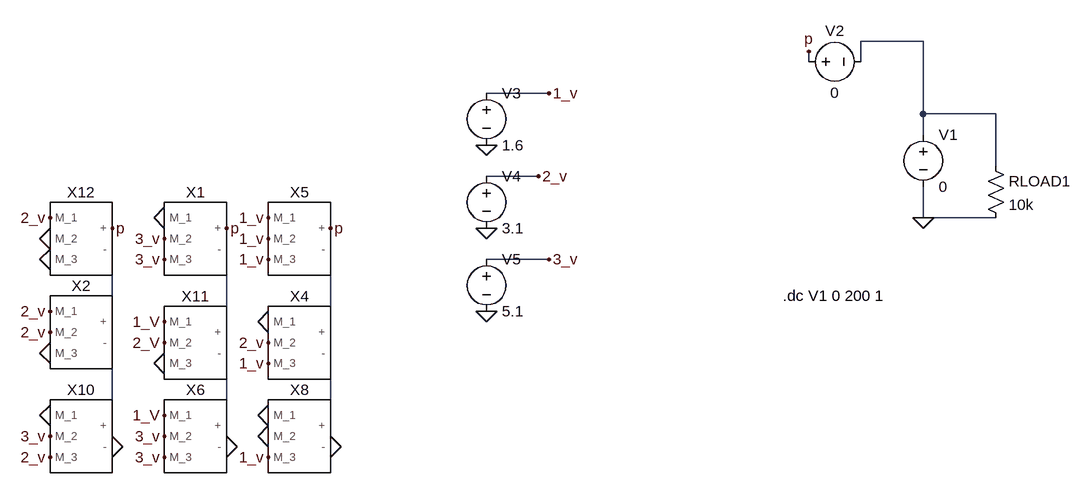
[diagram p0: schematic after.asc]
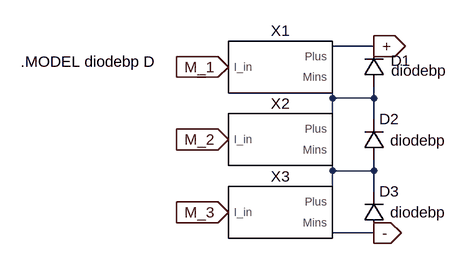
[diagram p1: sub-circuit pv_panel.asc]
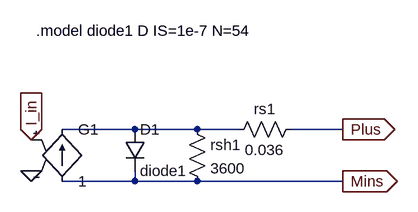
[diagram p2: sub-circuit module.asc]
after.asc, the LTspice schematic file:
Version 4
SHEET 1 1220 680
WIRE 928 -192 832 -192
WIRE 752 -160 752 -176
WIRE 832 -160 832 -192
WIRE 352 -112 256 -112
WIRE 928 -80 928 -192
WIRE 1040 -80 928 -80
WIRE 928 -48 928 -80
WIRE 1040 0 1040 -80
WIRE 336 16 256 16
WIRE 928 80 928 32
WIRE 1040 80 928 80
WIRE 352 144 256 144
WIRE -320 240 -320 128
WIRE -144 256 -144 128
WIRE 16 256 16 128
WIRE -320 400 -320 272
WIRE -144 400 -144 288
WIRE 16 400 16 288
FLAG 928 80 0
FLAG 16 432 0
FLAG -240 112 3_v
FLAG -240 144 3_v
FLAG -240 416 3_v
FLAG -240 448 3_v
FLAG -416 416 3_v
FLAG -80 80 1_v
FLAG -80 112 1_v
FLAG -80 144 1_v
FLAG -80 304 1_v
FLAG -80 448 1_v
FLAG -416 224 2_v
FLAG -416 256 2_v
FLAG -80 272 2_v
FLAG -416 80 2_v
FLAG -416 448 2_v
FLAG -416 288 0
FLAG -240 80 0
FLAG -416 384 0
FLAG -240 304 0
FLAG -416 112 0
FLAG -416 144 0
FLAG -80 416 0
FLAG -80 384 0
FLAG 752 -176 p
FLAG 16 96 p
FLAG -144 96 p
FLAG -320 432 0
FLAG -144 432 0
FLAG -320 96 p
FLAG -80 240 0
FLAG -240 384 1_V
FLAG -240 240 1_V
FLAG -240 272 2_V
FLAG 256 -32 0
FLAG 256 96 0
FLAG 256 224 0
FLAG 352 -112 1_v
FLAG 336 16 2_v
FLAG 352 144 3_v
SYMBOL PV_panel -192 112 R0
SYMATTR InstName X1
SYMBOL PV_panel -368 256 R0
SYMATTR InstName X2
SYMBOL PV_panel -32 272 R0
SYMATTR InstName X4
SYMBOL PV_panel -32 112 R0
SYMATTR InstName X5
SYMBOL PV_panel -192 416 R0
SYMATTR InstName X6
SYMBOL PV_panel -32 416 R0
SYMATTR InstName X8
SYMBOL PV_panel -368 416 R0
SYMATTR InstName X10
SYMBOL PV_panel -192 272 R0
SYMATTR InstName X11
SYMBOL PV_panel -368 112 R0
SYMATTR InstName X12
SYMBOL voltage 928 -64 R0
SYMATTR InstName V1
SYMATTR Value 0
SYMBOL voltage 736 -160 R270
WINDOW 0 32 56 VTop 2
WINDOW 3 -32 56 VBottom 2
SYMATTR InstName V2
SYMATTR Value 0
SYMBOL res 1024 -16 R0
SYMATTR InstName RLOAD1
SYMATTR Value 10k
SYMBOL voltage 256 -128 R0
SYMATTR InstName V3
SYMATTR Value 1.6
SYMBOL voltage 256 0 R0
SYMATTR InstName V4
SYMATTR Value 3.1
SYMBOL voltage 256 128 R0
SYMATTR InstName V5
SYMATTR Value 5.1
TEXT 712 200 Left 2 !.dc V1 0 200 1

pv_panel.asc, the sub-circuit schematic file:
Version 4
SHEET 1 880 680
WIRE 352 96 288 96
WIRE 288 112 288 96
WIRE 288 176 288 144
WIRE 352 176 352 160
WIRE 352 176 288 176
WIRE 352 208 352 176
WIRE 288 224 288 176
WIRE 288 288 288 256
WIRE 352 288 352 272
WIRE 352 288 288 288
WIRE 352 320 352 288
WIRE 288 336 288 288
WIRE 288 384 288 368
WIRE 352 384 288 384
FLAG 128 128 M_1
IOPIN 128 128 In
FLAG 128 240 M_2
IOPIN 128 240 In
FLAG 128 352 M_3
IOPIN 128 352 In
FLAG 352 96 +
IOPIN 352 96 Out
FLAG 352 384 -
IOPIN 352 384 Out
SYMBOL module 208 128 R0
SYMATTR InstName X1
SYMBOL module 208 240 R0
SYMATTR InstName X2
SYMBOL module 208 352 R0
SYMATTR InstName X3
SYMBOL diode 336 160 M180
WINDOW 0 42 42 Left 2
WINDOW 3 43 26 Left 2
SYMATTR InstName D1
SYMATTR Value diodebp
SYMBOL diode 336 272 M180
WINDOW 0 24 64 Left 2
WINDOW 3 41 31 Left 2
SYMATTR InstName D2
SYMATTR Value diodebp
SYMBOL diode 336 384 M180
WINDOW 0 24 64 Left 2
WINDOW 3 41 32 Left 2
SYMATTR InstName D3
SYMATTR Value diodebp
TEXT -192 120 Left 2 !.MODEL diodebp D

module.asc, the sub-circuit schematic file:
Version 4
SHEET 1 880 680
WIRE 128 64 16 64
WIRE 224 64 128 64
WIRE 288 64 224 64
WIRE 448 64 368 64
WIRE 128 144 128 128
WIRE 128 144 16 144
WIRE 224 144 128 144
WIRE 448 144 224 144
FLAG -32 128 0
FLAG -32 80 I_in
IOPIN -32 80 In
FLAG 448 64 Plus
IOPIN 448 64 Out
FLAG 448 144 Mins
IOPIN 448 144 Out
SYMBOL diode 112 64 R0
SYMATTR InstName D1
SYMATTR Value diode1
SYMBOL res 208 48 R0
SYMATTR InstName rsh1
SYMATTR Value 3600
SYMBOL res 384 48 R90
WINDOW 0 0 56 VBottom 2
WINDOW 3 32 56 VTop 2
SYMATTR InstName rs1
SYMATTR Value 0.036
SYMBOL g 16 48 R0
SYMATTR InstName G1
SYMATTR Value 1
TEXT -24 -88 Left 2 !.model diode1 D IS=1e-7 N=54

The netlist it stands for:
* after.asc
XX1 0 3_v 3_v p N003 pv_panel
XX2 2_v 2_v 0 N002 N005 pv_panel
XX4 0 2_v 1_v N004 N007 pv_panel
XX5 1_v 1_v 1_v p N004 pv_panel
XX6 1_v 3_v 3_v N006 0 pv_panel
XX8 0 0 1_v N007 0 pv_panel
XX10 0 3_v 2_v N005 0 pv_panel
XX11 1_v 2_v 0 N003 N006 pv_panel
XX12 2_v 0 0 p N002 pv_panel
V1 N001 0 0
V2 p N001 0
RLOAD1 N001 0 10k
V3 1_v 0 1.6
V4 2_v 0 3.1
V5 3_v 0 5.1

* block symbol definitions
.subckt pv_panel M_1 M_2 M_3 + -
XX1 M_1 + N001 module
XX2 M_2 N001 N002 module
XX3 M_3 N002 - module
D1 N001 + diodebp
D2 N002 N001 diodebp
D3 - N002 diodebp
.MODEL diodebp D
.ends pv_panel

.subckt module I_in Plus Mins
D1 N001 Mins diode1
rsh1 N001 Mins 3600
rs1 Plus N001 0.036
G1 Mins N001 I_in 0 1
.model diode1 D IS=1e-7 N=54
.ends module

.model D D
.lib standard.dio
.dc V1 0 200 1
.backanno
.end

* Results of the author's LTspice run, read from the files saved beside the schematic
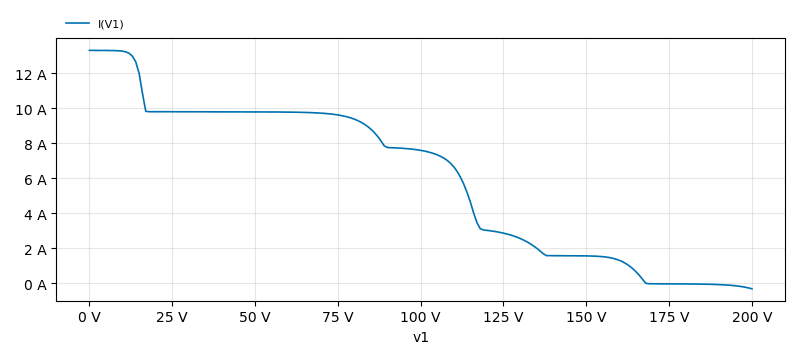
[diagram p3: DC transfer characteristic of after.asc, plotted from the saved traces]
* DC transfer characteristic, 1 run:
*   I(V1): 13.3 A at v1=0 V, -310.2 mA at v1=200 V, min -310.2 mA, max 13.3 A